# EAGLE schematic source_eagle (EAGLE 9.6.2)
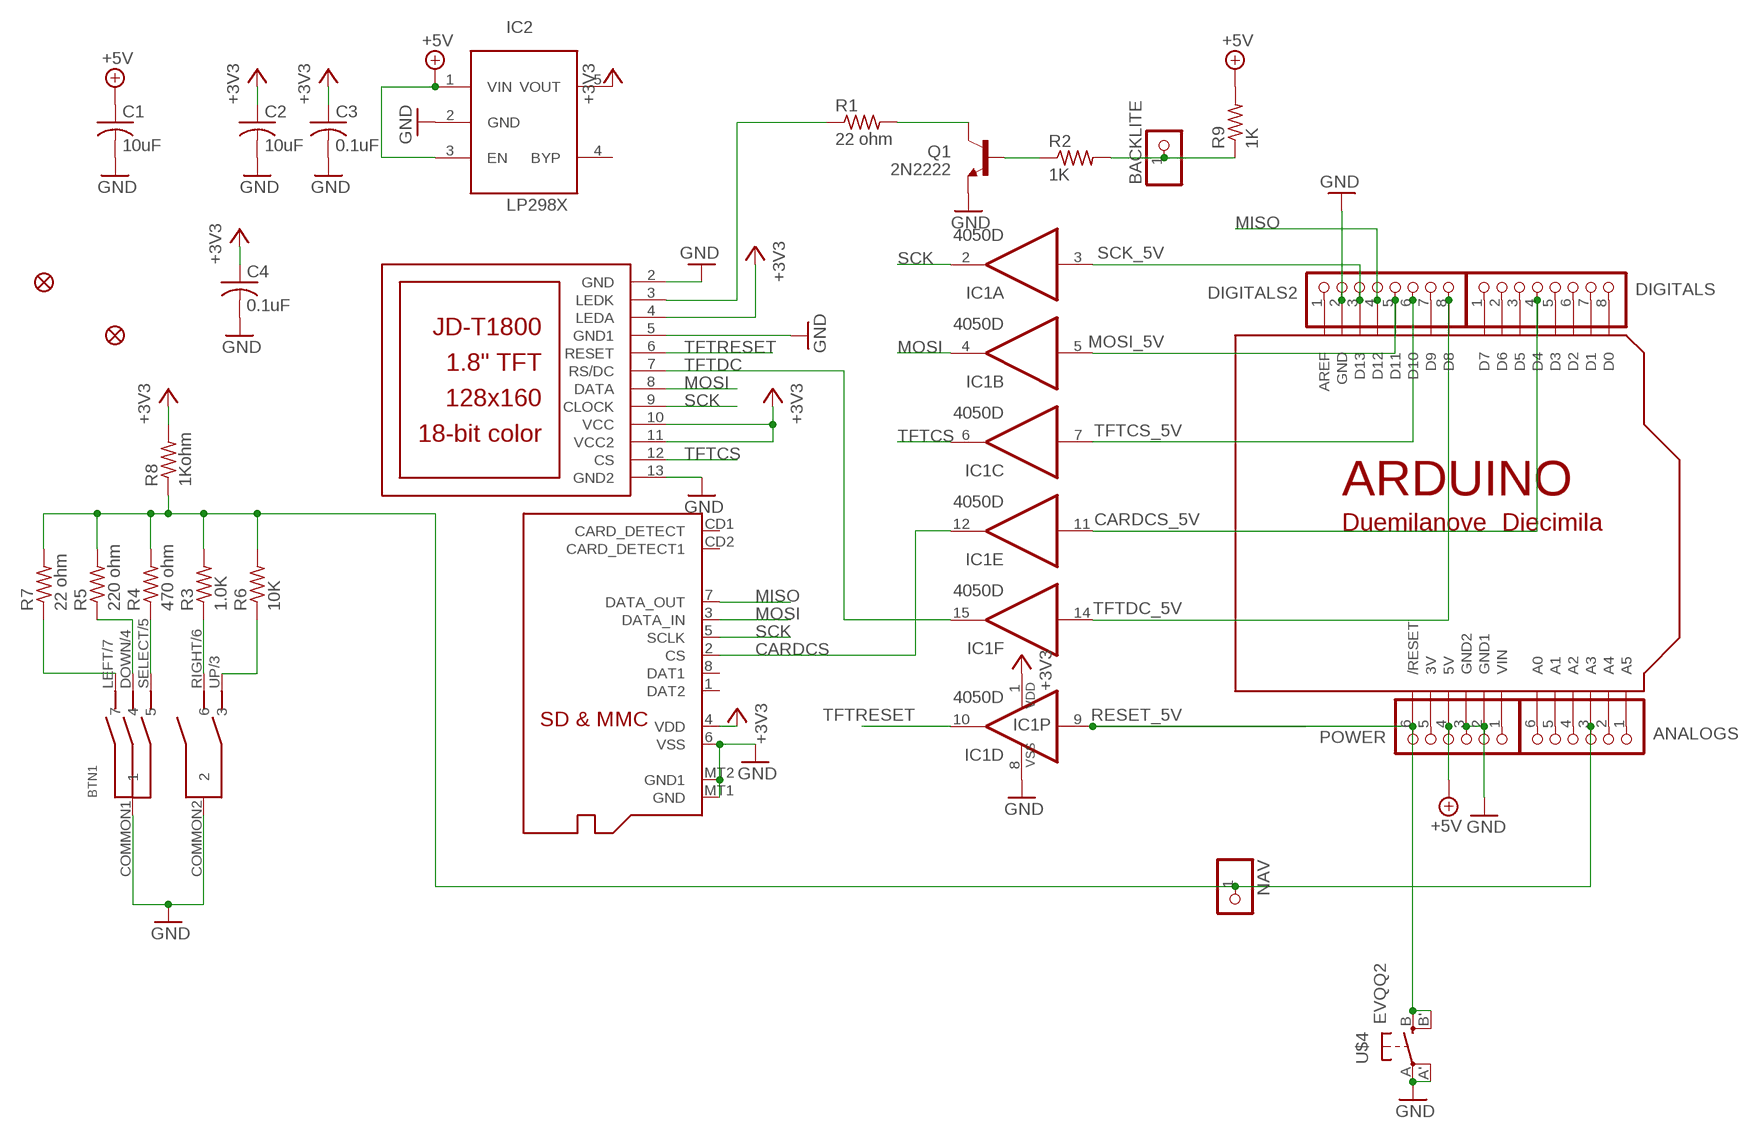
[diagram p0: schematic, sheet 1]

## Parts
ANALOGS  PINHD-1X6CB  [1X06-CLEANBIG]
BACKLITE  PINHD-1X1  [1X01]
BTN1  SWITCH_4WAY_TPA511GLFS  [SWITCH_4WAY_TPA511GLFS]
C1  10uF  C-USC0805K  [C0805K]
C2  10uF  C-USC0805K  [C0805K]
C3  0.1uF  C-USC0805K  [C0805K]
C4  0.1uF  C-USC0805K  [C0805K]
DIGITALS  PINHD-1X8CLEANBIG  [1X08-CLEANBIG]
DIGITALS2  PINHD-1X8CLEANBIG  [1X08-CLEANBIG]
FID1  FIDUCIAL1X2.5  [FIDUCIAL-1X2.5]
FID3  FIDUCIAL1X2.5  [FIDUCIAL-1X2.5]
IC1  4050D  [SO16]
IC2  RT9193-33GB  LP298XS  [SOT23-5L]
NAV  PINHD-1X1  [1X01]
POWER  PINHD-1X6CB  [1X06-CLEANBIG]
Q1  2N2222  MMBT2222ALT1-NPN-SOT23-BEC  [SOT23-BEC]
R1  22 ohm  R-US_R0805  [R0805]
R2  1K  R-US_R0805  [R0805]
R3  1.0K  R-US_R0805  [R0805]
R4  470 ohm  R-US_R0805  [R0805]
R5  220 ohm  R-US_R0805  [R0805]
R6  10K  R-US_R0805  [R0805]
R7  22 ohm  R-US_R0805  [R0805]
R8  1Kohm  R-US_R0805  [R0805]
R9  1K  R-US_R0805  [R0805]
U$1  JD-T1800  [JD-T1800]
U$2  ARDUINOUNO  [ARDUINO]
U$3  MICROSD  [MICROSD]
U$4  EVQQ2  [EVQ-Q2]

## Nets
+3V3 [power]: C2.1 C3.1 C4.1 IC1.1(P:VDD) IC2.5(VOUT) R8.2 U$1.4(LEDA) U$1.10(VCC) U$1.11(VCC2) U$3.4(VDD)
+5V [power]: C1.1 IC2.1(VIN) IC2.3(EN) POWER.4 R9.2 U$2.5V
CARDCS: IC1.12(E:O) U$3.2(CS)
CARDCS_5V: DIGITALS.4 IC1.11(E:I) U$2.D4
GND: BTN1.COMMON1 BTN1.COMMON2 C1.2 C2.2 C3.2 C4.2 DIGITALS2.2 IC1.8(P:VSS) IC2.2(GND) POWER.2 POWER.3 Q1.E U$1.2(GND) U$1.5(GND1) U$1.13(GND2) U$2.GND U$2.GND1 U$2.GND2 U$3.6(VSS) U$3.MT1(GND) U$3.MT2(GND1) U$4.A'(P1) U$4.A(P)
MISO: DIGITALS2.4 U$2.D12 U$3.7(DATA_OUT)
MOSI: IC1.4(B:O) U$1.8(DATA) U$3.3(DATA_IN)
MOSI_5V: DIGITALS2.5 IC1.5(B:I) U$2.D11
N$1: Q1.B R2.1
N$2: BTN1.LEFT/7 R7.1
N$3: BTN1.DOWN/4 R5.1
N$4: R1.1 U$1.3(LEDK)
N$5: Q1.C R1.2
N$6: DIGITALS2.7 U$2.D9
N$7: BTN1.SELECT/5 R4.1
N$8: BTN1.RIGHT/6 R3.1
N$9: BTN1.UP/3 R6.1
N$10: ANALOGS.3 NAV.1 R3.2 R4.2 R5.2 R6.2 R7.2 R8.1 U$2.A3
N$11: DIGITALS.1 U$2.D7
N$12: DIGITALS.2 U$2.D6
N$13: DIGITALS.3 U$2.D5
N$14: DIGITALS.5 U$2.D3
N$15: DIGITALS.6 U$2.D2
N$16: DIGITALS.7 U$2.D1
N$17: DIGITALS.8 U$2.D0
N$18: DIGITALS2.1 U$2.AREF
N$19: ANALOGS.1 U$2.A5
N$20: ANALOGS.2 U$2.A4
N$21: ANALOGS.4 U$2.A2
N$22: ANALOGS.5 U$2.A1
N$23: ANALOGS.6 U$2.A0
N$24: POWER.1 U$2.VIN
N$25: POWER.5 U$2.3V
N$26: BACKLITE.1 R2.2 R9.1
RESET_5V: IC1.9(D:I) POWER.6 U$2.RESET(/RESET) U$4.B'(S1) U$4.B(S)
SCK: IC1.2(A:O) U$1.9(CLOCK) U$3.5(SCLK)
SCK_5V: DIGITALS2.3 IC1.3(A:I) U$2.D13
TFTCS: IC1.6(C:O) U$1.12(CS)
TFTCS_5V: DIGITALS2.6 IC1.7(C:I) U$2.D10
TFTDC: IC1.15(F:O) U$1.7(RS/DC)
TFTDC_5V: DIGITALS2.8 IC1.14(F:I) U$2.D8
TFTRESET: IC1.10(D:O) U$1.6(RESET)
Unconnected: IC2.4(BYP) U$3.1(DAT2) U$3.8(DAT1) U$3.CD1(CARD_DETECT) U$3.CD2(CARD_DETECT1)

## Library data of the parts
ANALOGS POWER = adafruit:PINHD-1X6: PIN HEADER
BACKLITE NAV = pinhead:PINHD-1X1: PIN HEADER
BTN1 = microbuilder:SWITCH_4WAY_TPA511GLFS
C1-C4 = rcl:C-US: CAPACITOR, American symbol
DIGITALS DIGITALS2 = adafruit:PINHD-1X8: PIN HEADER
FID1 FID3 = microbuilder:FIDUCIAL: Fiducial Alignment Points Various fiducial points for machine vision alignment.
IC1 = 40xx:4050: Hex non-inverting BUFFER
IC2 = adafruit:LP298X
Q1 = transistor:*-NPN-: NPN Transistror BF959 corrected 2008.03.06
R1-R9 = adafruit:R-US_: RESISTOR, American symbol
U$1 = adafruit:JD-T1800
U$2 = adafruit:ARDUINO: Arduino Diecimila/Duemilanove Make a shield with ease, this package has all the named pins as well as the two mounting drill holes and an outline of the USB and DC power connector. The outline is on the DIMENSION layer, so if your board house uses it they will cut the outline to match. http://www.ladyada.net/library/pcb/eaglelibrary.html
U$3 = adafruit:MICROSD: Micro-SD / Transflash card holder with SPI pinout For the 3M # 2908-05WB-MG and/or 4UCON #19656 push-push type
U$4 = adafruit:EVQQ2: SMT 6mm switch, EVQQ2 series http://www.ladyada.net/library/eagle

## Net classes
1 power: width 0.406 mm